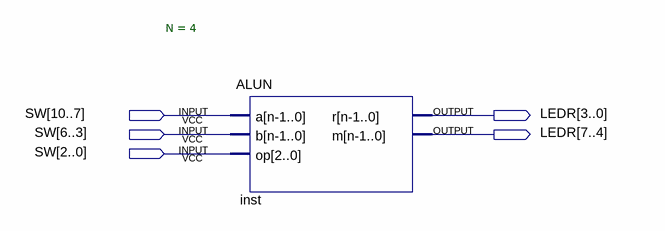
[diagram p0: schematic sheet]
// Quartus schematic ALUN_Demo.bdf as structural Verilog: 1 symbols, 5 pins
module ALUN_Demo (
  input  [10:0] SW,
  output [7:0] LEDR
);

  ALUN #(.N(4)) inst (.a(SW[10:7]), .b(SW[6:3]), .op(SW[2:0]), .r(LEDR[3:0]), .m(LEDR[7:4]));
endmodule
